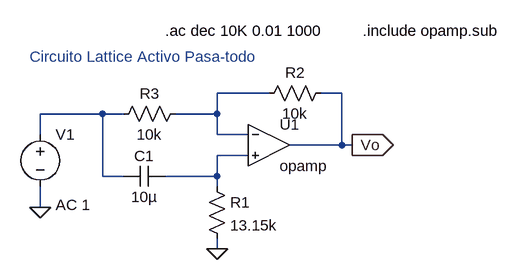
[diagram p0: schematic EJE1_Activa.asc]
EJE1_Activa.asc, the LTspice schematic file:
Version 4
SHEET 1 880 680
WIRE 208 112 128 112
WIRE 320 112 288 112
WIRE -48 144 -144 144
WIRE -16 144 -48 144
WIRE 128 144 128 112
WIRE 128 144 64 144
WIRE -144 176 -144 144
WIRE 128 176 128 144
WIRE 176 176 128 176
WIRE 320 192 320 112
WIRE 320 192 240 192
WIRE 336 192 320 192
WIRE 176 208 128 208
WIRE -48 240 -48 144
WIRE -16 240 -48 240
WIRE 128 240 128 208
WIRE 128 240 48 240
WIRE 128 256 128 240
WIRE -144 288 -144 256
WIRE 128 352 128 336
FLAG -144 288 0
FLAG 128 352 0
FLAG 336 192 Vo
IOPIN 336 192 Out
SYMBOL OpAmps\\opamp 208 128 R0
SYMATTR InstName U1
SYMBOL res 112 240 R0
SYMATTR InstName R1
SYMATTR Value 13.15k
SYMBOL cap 48 224 R90
WINDOW 0 0 32 VBottom 2
WINDOW 3 32 32 VTop 2
SYMATTR InstName C1
SYMATTR Value 10µ
SYMBOL res 304 96 R90
WINDOW 0 0 56 VBottom 2
WINDOW 3 32 56 VTop 2
SYMATTR InstName R2
SYMATTR Value 10k
SYMBOL res 80 128 R90
WINDOW 0 0 56 VBottom 2
WINDOW 3 32 56 VTop 2
SYMATTR InstName R3
SYMATTR Value 10k
SYMBOL voltage -144 160 R0
WINDOW 123 24 124 Left 2
WINDOW 39 0 0 Left 0
SYMATTR Value2 AC 1
SYMATTR InstName V1
SYMATTR Value ""
TEXT 48 16 Left 2 !.ac dec 10K 0.01 1000
TEXT 352 16 Left 2 !.include opamp.sub
TEXT -160 56 Left 2 ;Circuito Lattice Activo Pasa-todo

The netlist it stands for:
* EJE1_Activa.asc
XU1 N001 N003 Vo opamp Aol=100K GBW=10Meg  ; pins invin noninvin out
R1 N003 0 13.15k
C1 N003 N002 10µ
R2 Vo N001 10k
R3 N001 N002 10k
V1 N002 0 AC 1
.ac dec 10K 0.01 1000
.include opamp.sub
* Circuito Lattice Activo Pasa-todo
.backanno
.end